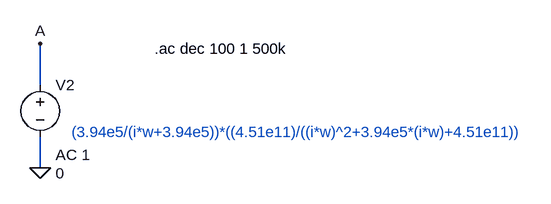
[diagram p0: schematic Verificare_fdt.asc]
Verificare_fdt.asc, the LTspice schematic file:
Version 4
SHEET 1 2700 1708
WIRE 432 -224 432 -288
WIRE 432 -96 432 -144
FLAG 432 -96 0
FLAG 432 -288 A
SYMBOL voltage 432 -240 R0
WINDOW 123 24 124 Left 2
WINDOW 39 0 0 Left 2
WINDOW 3 24 152 Left 2
SYMATTR Value2 AC 1
SYMATTR Value 0
SYMATTR InstName V2
TEXT 608 -280 Left 2 !.ac dec 100 1 500k
TEXT 480 -152 Left 2 ;(3.94e5/(i*w+3.94e5))*((4.51e11)/((i*w)^2+3.94e5*(i*w)+4.51e11))

The netlist it stands for:
* Verificare_fdt.asc
V2 A 0 0 AC 1
.ac dec 100 1 500k
* (3.94e5/(i*w+3.94e5))*((4.51e11)/((i*w)^2+3.94e5*(i*w)+4.51e11))
.backanno
.end